# EAGLE design ioshield (EAGLE 7.2.0)
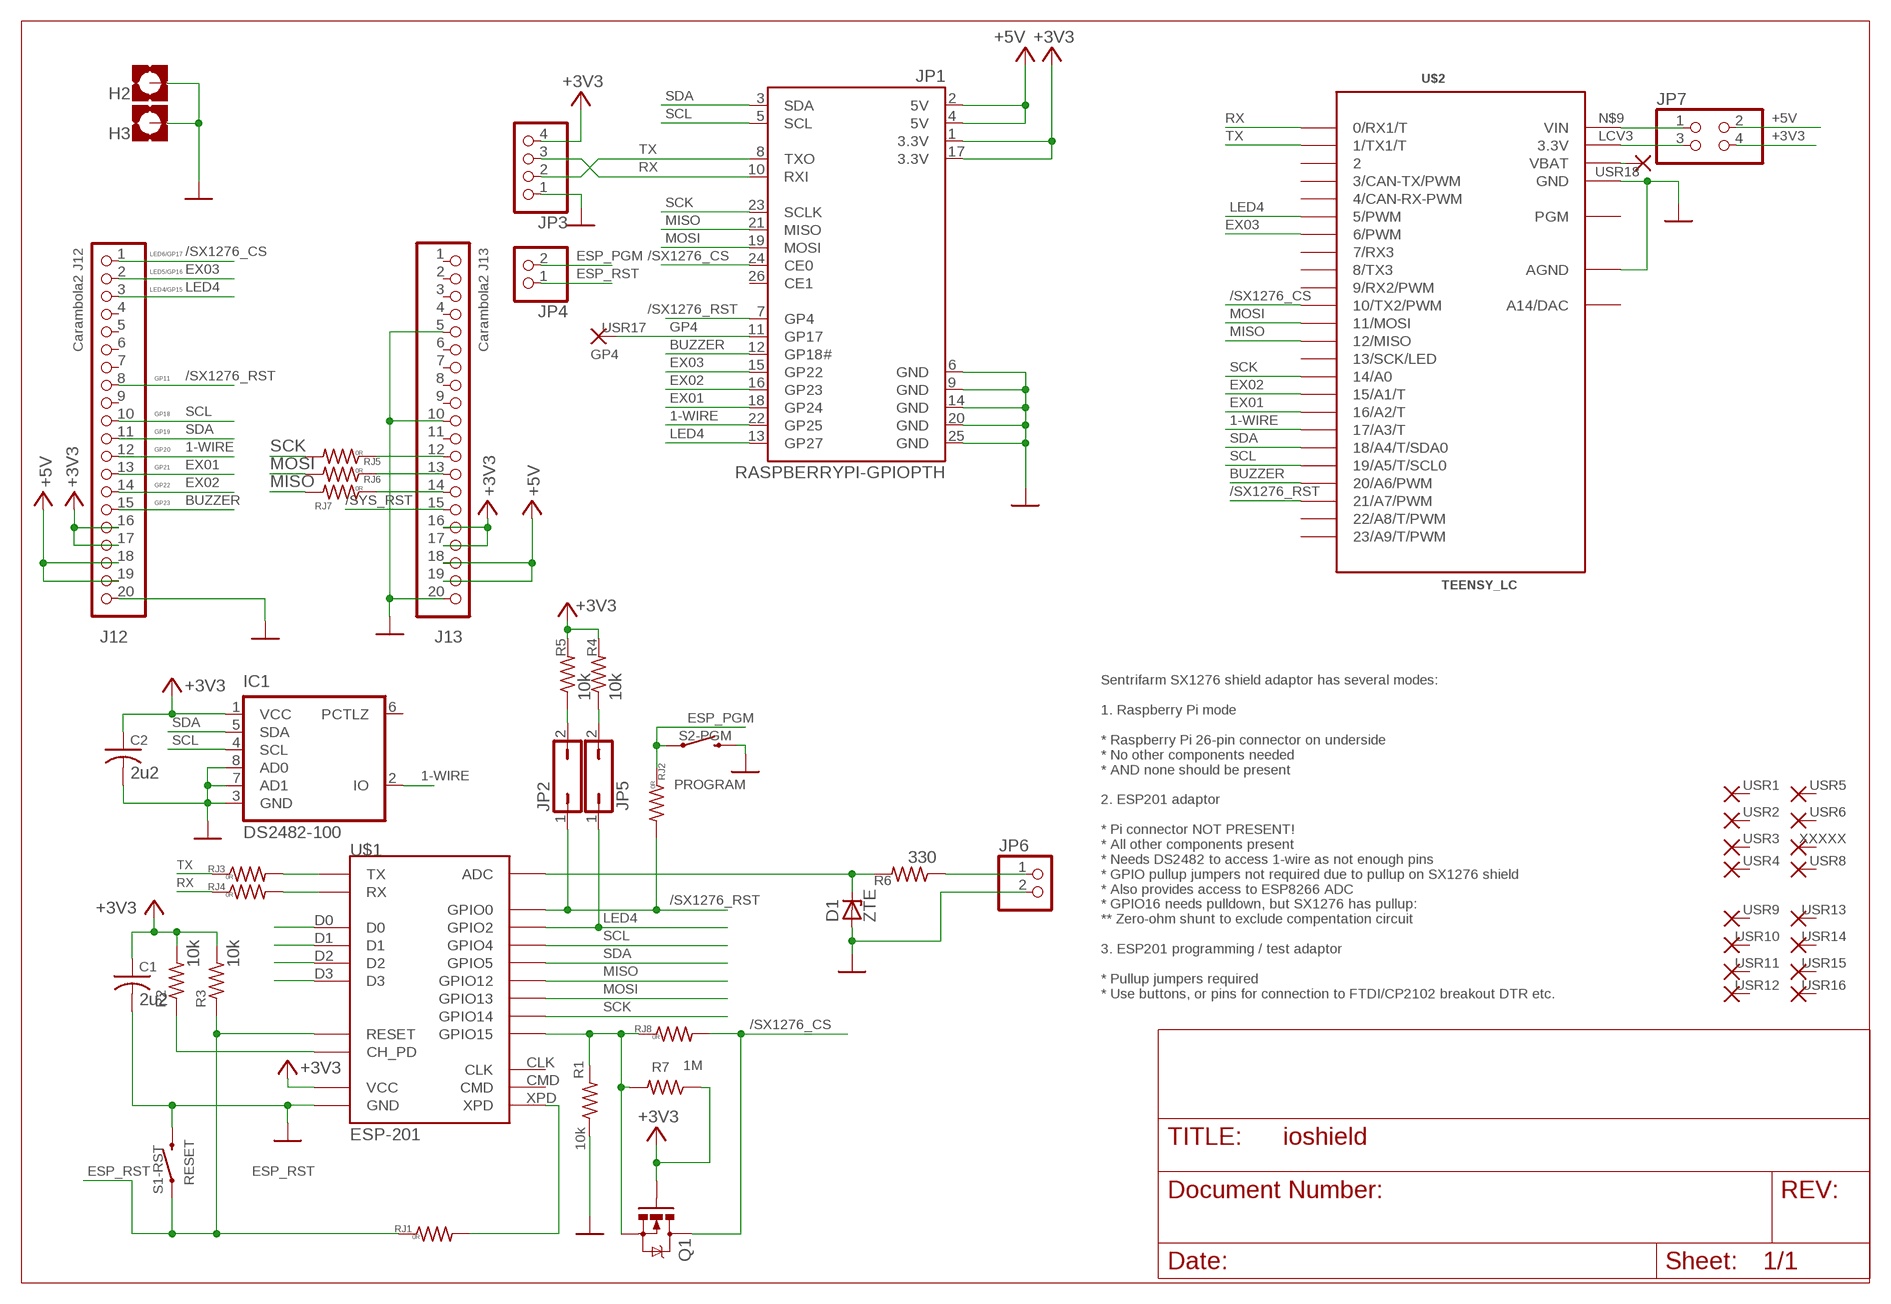
[diagram p0: schematic, sheet 1]

## Parts
C1  2u2  C-USC1206  [C1206]
C2  2u2  C-USC1206  [C1206]
D1  ZTE  [DO35Z10]
H2  MOUNT-PAD-SQUARE3.2  [3,2-PAD-SQUARE]
H3  MOUNT-PAD-SQUARE3.2  [3,2-PAD-SQUARE]
IC1  DS2482-100  [SO08]
J12  Carambola2 J12  PINHD-1X20  [1X20]
J13  Carambola2 J13  PINHD-1X20  [1X20]
JP1  RASPBERRYPI-GPIOPTH  [2X13-SHROUDED]
JP2  JP1Q  [JP1]
JP3  PINHD-1X4  [1X04]
JP4  PINHD-1X2  [1X02]
JP5  JP1Q  [JP1]
JP6  PINHD-1X2  [1X02]
JP7  PINHD-2X2  [2X02]
Q1  MOSFET-NCHANNEL2N7000  [TO-92]
R1  10k  R-US_M1206  [M1206]
R2  10k  R-US_M1206  [M1206]
R3  10k  R-US_M1206  [M1206]
R4  10k  R-US_M1206  [M1206]
R5  10k  R-US_M1206  [M1206]
R6  330  R-US_M1206  [M1206]
R7  1M  R-US_M1206  [M1206]
RJ1  0R  R-US_M1206  [M1206]
RJ2  0R  R-US_M1206  [M1206]
RJ3  0R  R-US_M1206  [M1206]
RJ4  0R  R-US_M1206  [M1206]
RJ5  0R  R-US_M1206  [M1206]
RJ6  0R  R-US_M1206  [M1206]
RJ7  0R  R-US_M1206  [M1206]
RJ8  0R  R-US_M1206  [M1206]
S1-RST  SWITCH-MOMENTARY-2PTH  [TACTILE-PTH]
S2-PGM  SWITCH-MOMENTARY-2PTH  [TACTILE-PTH]
U$1  ESP-201  [ESP-201]
U$2  TEENSY_LC  TEENSY_3.1_BASIC  [TEENSY_3.1_BASIC]
USR1  1,6/0,8  [1,6/0,8]
USR2  1,6/0,8  [1,6/0,8]
USR3  1,6/0,8  [1,6/0,8]
USR4  1,6/0,8  [1,6/0,8]
USR5  1,6/0,8  [1,6/0,8]
USR6  1,6/0,8  [1,6/0,8]
USR8  1,6/0,8  [1,6/0,8]
USR9  1,6/0,8  [1,6/0,8]
USR10  1,6/0,8  [1,6/0,8]
USR11  1,6/0,8  [1,6/0,8]
USR12  1,6/0,8  [1,6/0,8]
USR13  1,6/0,8  [1,6/0,8]
USR14  1,6/0,8  [1,6/0,8]
USR15  1,6/0,8  [1,6/0,8]
USR16  1,6/0,8  [1,6/0,8]
USR17  GP4  1,6/0,8  [1,6/0,8]
USR18  1,6/0,8  [1,6/0,8]
XXXXX  1,6/0,8  [1,6/0,8]

## Nets
1-WIRE: IC1.2(IO) J12.12 JP1.22(GP25) U$2.17/A3(17/A3/T)
+3V3 [power]: C1.1 C2.1 IC1.1(VCC) J12.16 J12.17 J13.16 J13.17 JP1.1(3.3V) JP1.17(3.3V) JP3.4 JP7.4 Q1.2(G) R2.2 R3.2 R4.2 R5.2 R7.1 U$1.3V3(VCC) U$1.3V3_2(VCC) U$1.3V3_3(VCC)
+5V [power]: J12.18 J12.19 J13.18 J13.19 JP1.2(5V) JP1.4(5V) JP7.2
/SX1276_CS: J12.1 JP1.24(CE0) Q1.3(D) RJ8.2 U$2.10(10/TX2/PWM)
/SX1276_RST: J12.8 JP1.7(GP4) JP2.1 RJ2.2 U$1.GPIO0 U$2.21/A7(21/A7/PWM)
/SYS_RST: J13.15
BUZZER: J12.15 JP1.12(GP18#) U$2.20/A6(20/A6/PWM)
CH_PD: R2.1 U$1.CH_PD
ESP_ADC: D1.C R6.2 U$1.ADC
ESP_GPIO15: Q1.1(S) R1.2 R7.2 RJ8.1 U$1.GPIO15
ESP_PGM: JP4.2 RJ2.1 S2-PGM.1
ESP_RST: JP4.1 R3.1 RJ1.1 S1-RST.1 U$1.RST(RESET)
EX01: J12.13 JP1.18(GP24) U$2.16/A2(16/A2/T)
EX02: J12.14 JP1.16(GP23) U$2.15/A1(15/A1/T)
EX03: J12.2 JP1.15(GP22) U$2.6(6/PWM)
GND: C1.2 C2.2 D1.A H2.B3,2(MOUNT) H3.B3,2(MOUNT) IC1.3(GND) IC1.7(AD1) IC1.8(AD0) J12.20 J13.5 J13.10 J13.20 JP1.6(GND) JP1.9(GND) JP1.14(GND) JP1.20(GND) JP1.25(GND) JP3.1 JP6.2 R1.1 S1-RST.3 S2-PGM.3 U$1.GND U$1.GND_2(GND) U$1.GND_3(GND) U$2.AGND U$2.GND U$2.GND1(GND)
GP4: JP1.11(GP17) USR17.1(P)
LCV3: JP7.3 U$2.3.3V U$2.3.3V1(3.3V)
LED4: J12.3 JP1.13(GP27) JP5.1 U$1.GPIO2 U$2.5(5/PWM)
MISO: JP1.21(MISO) RJ7.2 U$1.GPIO12 U$2.12(12/MISO)
MOSI: JP1.19(MOSI) RJ6.2 U$1.GPIO13 U$2.11(11/MOSI)
N$1: JP2.2 R5.1
N$2: JP5.2 R4.1
N$3: JP6.1 R6.1
N$4: RJ3.2
N$5: U$1.D1
N$6: U$2.VBAT USR18.1(P)
N$7: U$1.D3
N$8: U$1.D2
N$9: JP7.1 U$2.VIN
N$10: U$1.D0
N$11: RJ4.2
NXXX1: J13.12 RJ5.1
NXXX2: J13.13 RJ6.1
NXXX3: J13.14 RJ7.1
RX: JP1.10(RXI) JP3.3 RJ4.1 U$2.0(0/RX1/T)
SCK: JP1.23(SCLK) RJ5.2 U$1.GPIO14 U$2.14/A0
SCL: IC1.4(SCL) J12.10 JP1.5(SCL) U$1.GPIO4 U$2.19/A5(19/A5/T/SCL0)
SDA: IC1.5(SDA) J12.11 JP1.3(SDA) U$1.GPIO5 U$2.18/A4(18/A4/T/SDA0)
TX: JP1.8(TXO) JP3.2 RJ3.1 U$2.1(1/TX1/T)
XPD: RJ1.2 U$1.XPD
Unconnected: IC1.6(PCTLZ) J12.4 J12.5 J12.6 J12.7 J12.9 J13.1 J13.2 J13.3 J13.4 J13.6 J13.7 J13.8 J13.9 J13.11 JP1.26(CE1) U$1.CLK U$1.CMD U$1.RX U$1.TX U$2.2 U$2.3(3/CAN-TX/PWM) U$2.4(4/CAN-RX-PWM) U$2.7(7/RX3) U$2.8(8/TX3) U$2.9(9/RX2/PWM) U$2.13(13/SCK/LED) U$2.22/A8(22/A8/T/PWM) U$2.23/A9(23/A9/T/PWM) U$2.A14(A14/DAC) U$2.PGM USR1.1(P) USR2.1(P) USR3.1(P) USR4.1(P) USR5.1(P) USR6.1(P) USR8.1(P) USR9.1(P) USR10.1(P) USR11.1(P) USR12.1(P) USR13.1(P) USR14.1(P) USR15.1(P) USR16.1(P) XXXXX.1(P)

## Notes on the sheet
- LED6/GP17
- LED5/GP16
- LED4/GP15
- GP11
- GP18
- GP19
- GP20
- GP21
- GP22
- GP23
- PROGRAM
- Sentrifarm SX1276 shield adaptor has several modes:
  
  1. Raspberry Pi mode
  
  * Raspberry Pi 26-pin connector on underside
  * No other components needed
  * AND none should be present
  
  2. ESP201 adaptor
  
  * Pi connector NOT PRESENT!
  * All other components present
  * Needs DS2482 to access 1-wire as not enough pins
  * GPIO pullup jumpers not required due to pullup on SX1276 shield
  * Also provides access to ESP8266 ADC
  * GPIO16 needs pulldown, but SX1276 has pullup:
  ** Zero-ohm shunt to exclude compentation circuit
  
  3. ESP201 programming / test adaptor
  
  * Pullup jumpers required 
  * Use buttons, or pins for connection to FTDI/CP2102 breakout DTR etc.
- RESET

## Library data of the parts
C1 C2 = resistor:C-US: CAPACITOR, American symbol
D1 = diode:ZTE: Z DIODE 300 mW
H2 H3 = holes:MOUNT-PAD-SQUARE: MOUNTING PAD, square
IC1 = poepi-myparts:DS2482-100: Single channel 1-Wire master with I2C interface
J12 J13 = PINHEAD:PINHD-1X20
JP1 = SparkFun-Boards:RASPBERRYPI-GPIO: RASPBERRY PI I/O HEADER As defined for the Revistion 2 Pi.; DIST: sparkfun; DIST_ID: PRT-11490
JP2 JP5 = jumper:JP1Q: JUMPER
JP3 = PINHEAD:PINHD-1X4: PIN HEADER
JP4 JP6 = PINHEAD:PINHD-1X2: PIN HEADER
JP7 = PINHEAD:PINHD-2X2: PIN HEADER
Q1 = SparkFun-DiscreteSemi:MOSFET-NCHANNEL: Common NMOSFET Parts MFG P/N Store ID Prod ID FDD8780 TRANS-09984 SI7820DN TRANS-11055 FDS6630A IC-08089 2N7002PW TRANS-11151 FQP30N06L COM-10213 TRANS-10060 BSS123LT1G TRANS-08345 BSS138 TRANS-00830 BS170 2N7000
R1-R7 RJ1-RJ8 = resistor:R-US_: RESISTOR, American symbol
S1-RST S2-PGM = SparkFun-Electromechanical:SWITCH-MOMENTARY-2: Various NO switches- pushbuttons, reed, etc; PROD_ID: SWCH-08441
U$1 = esp8266modules:ESP-201: ESP8266 Wifi Module ESP-201; DIMENSIONS: 25 x 35 mm; PINS: 26; PITCH: 0.1" / 2.54 mm
U$2 = Teensy_3_Series_Board_v1.0:TEENSY_3.1_BASIC: Footprint for Teensy 3.1 board using all pin connections on the outer perimeter
USR1-USR6 USR8-USR18 XXXXX = wirepad:1,6/0,8: THROUGH-HOLE PAD

## Net classes
1 power: width 0.305 mm

## Board
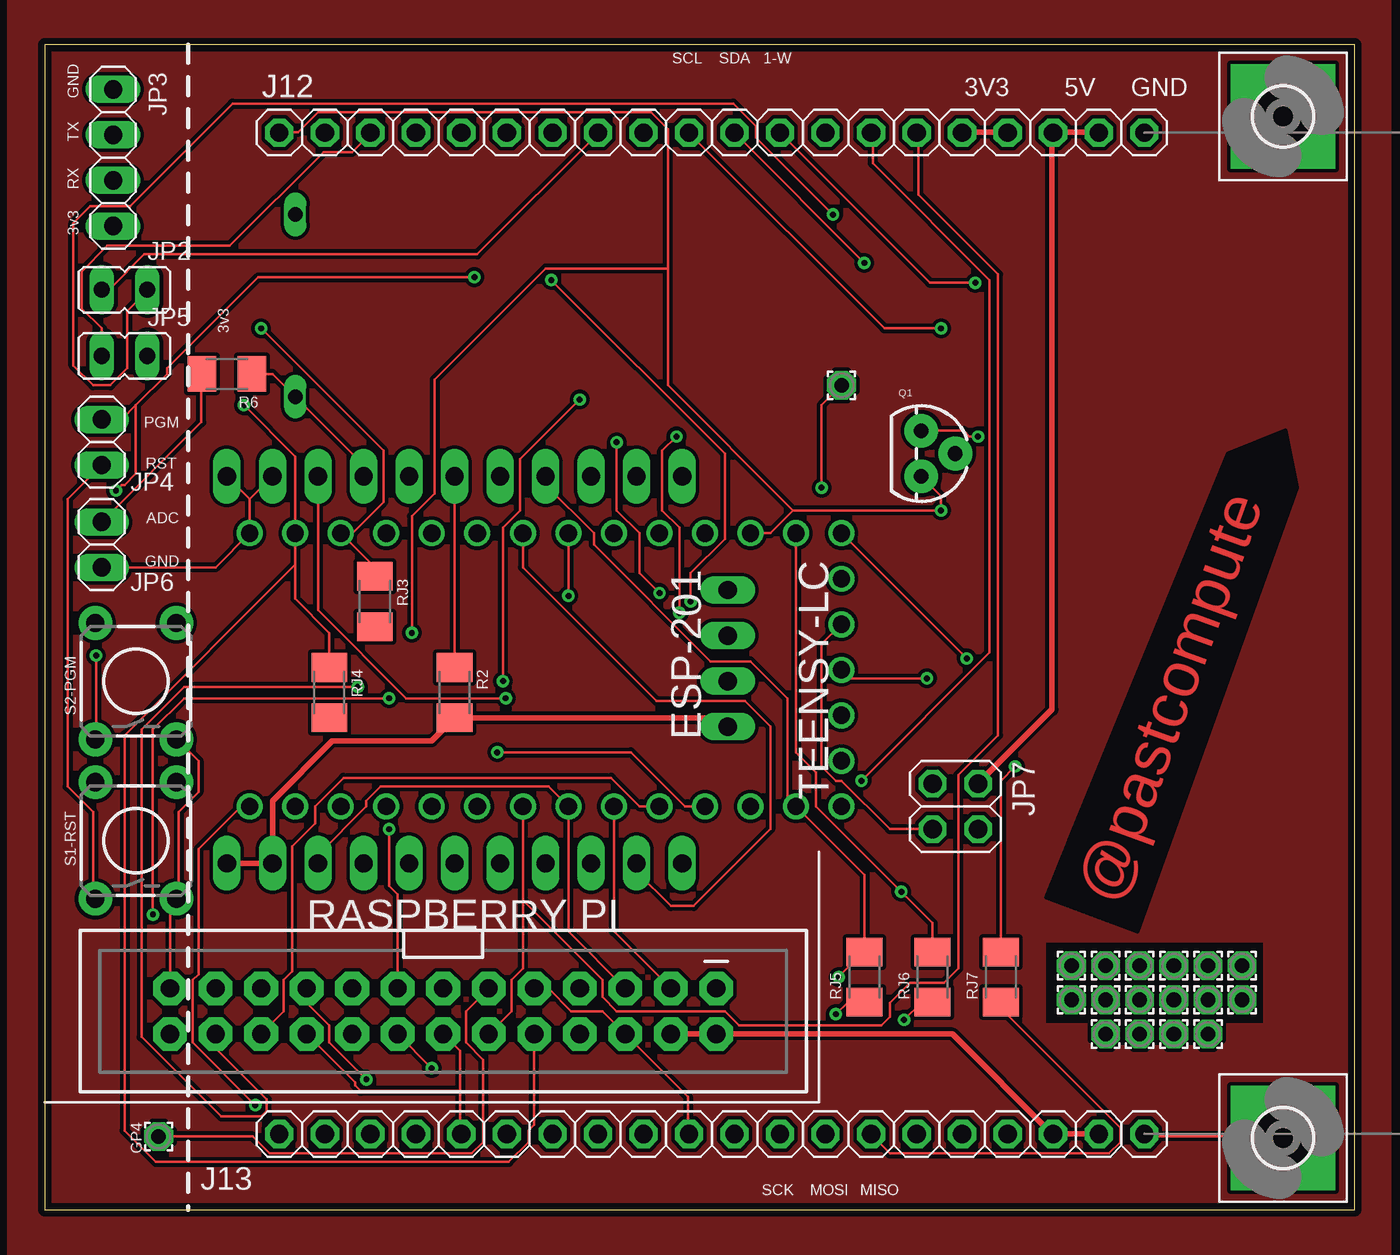
[diagram p1: board, top side]
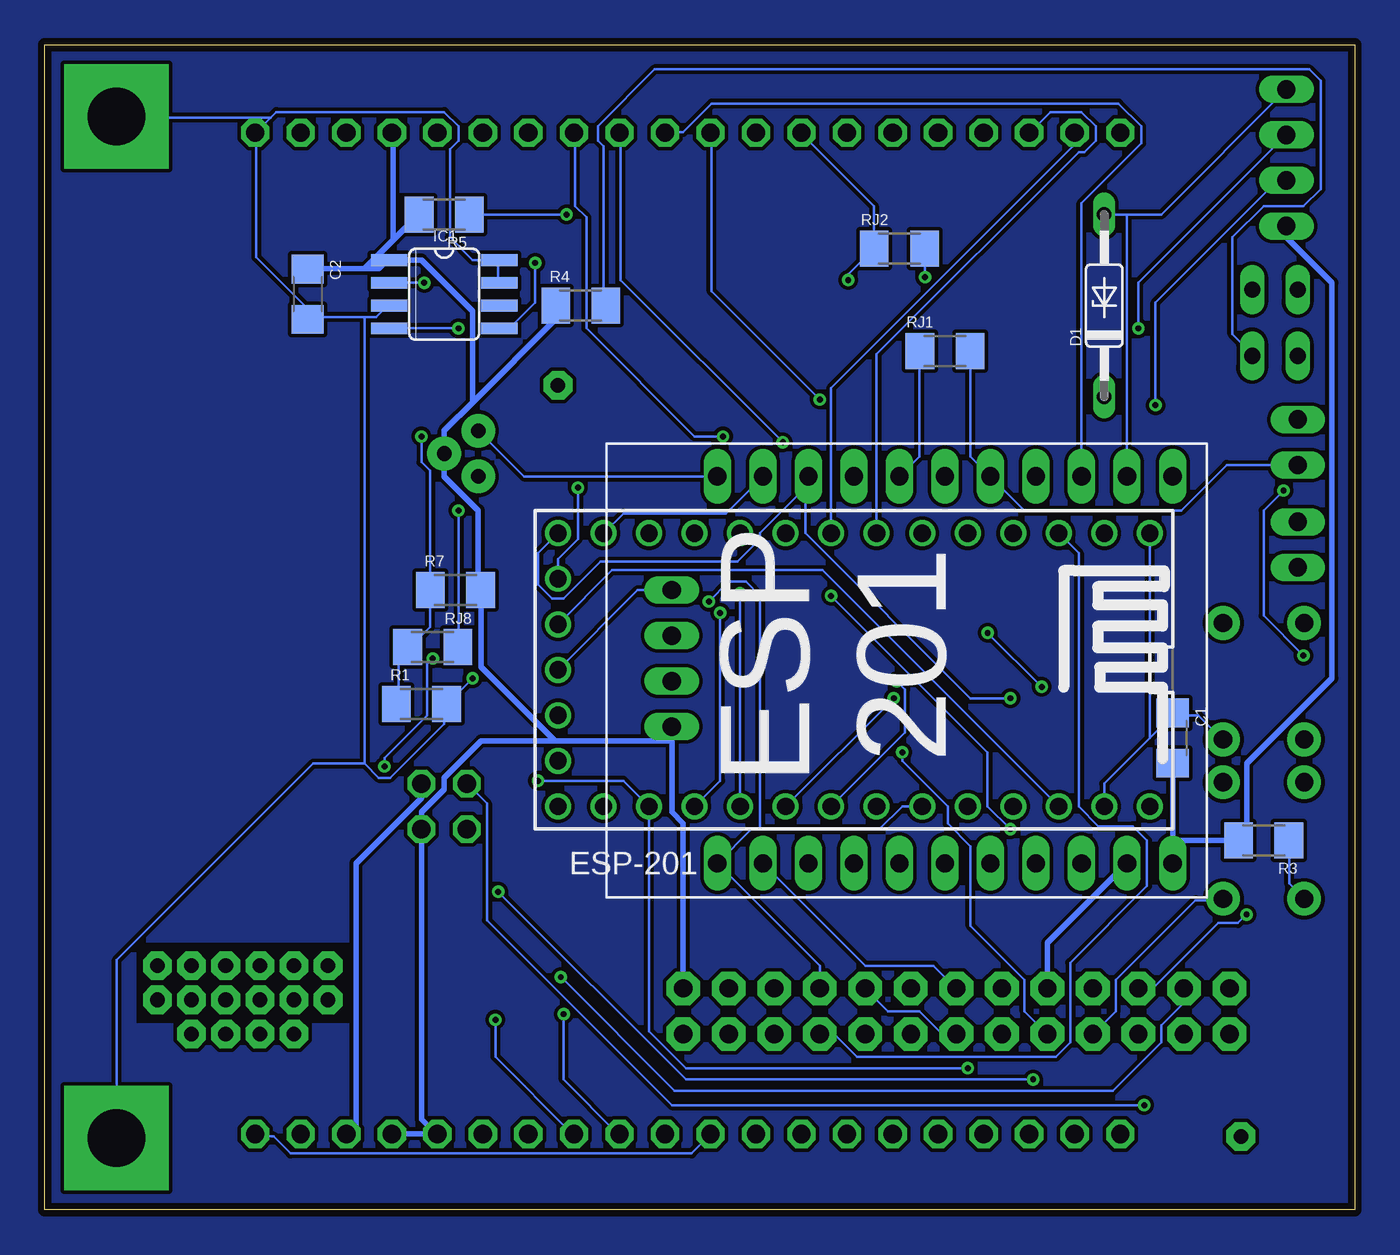
[diagram p2: board, bottom side, seen from below]

Size 73.08 x 65 mm. Coordinates in mm from the lower left corner, seen from the top.
Outline: 0,0 73.08,0 73.08,65 0,65 0,0
Copper layers (1*16): Top 0.0356mm / dielectric 1.5011mm / Bottom 0.0356mm
Design rules "LaenPCBOrder *": minimum track width 6mil, minimum drill 13mil, track to track 8mil, track to pad 8mil, pad to pad 8mil, via to via 8mil, smd to smd 6mil, copper to edge 15mil, drill to drill 6mil, minimum pad ring 7mil, minimum via ring 7mil, stop-mask expansion 3mil, vias tented up to drill 0mil, thermal gap 10mil
tRestrict: area 55.9,10.4 to 67.9,14.9; area 55.9,15.5 to 69.9,43.5
bRestrict: area 55.9,10.4 to 67.9,14.9
vRestrict: area 57.9,18.4 to 73.2,37.7

### Footprints (pad centres in the part's own frame; a part is rotated, then mirrored left to right if it is on the bottom)
C1206 = smd 1.6 x 1.8: 1 -1.4,0; 2 1.4,0
DO35Z10 = drill 0.813 long: A 5.08,0; C -5.08,0
3,2-PAD-SQUARE = drill 3.2 pad 5.842 square: B3,2 0,0
SO08 = smd 0.66 x 2.032: 1 -1.905,-3.073; 2 -0.635,-3.073; 3 0.635,-3.073; 4 1.905,-3.073; 5 1.905,3.073; 6 0.635,3.073; 7 -0.635,3.073; 8 -1.905,3.073
1X20 = drill 1.016 pad 1.575 octagon: 1 -24.13,0; 2 -21.59,0; 3 -19.05,0; 4 -16.51,0; 5 -13.97,0; 6 -11.43,0; 7 -8.89,0; 8 -6.35,0; 9 -3.81,0; 10 -1.27,0; 11 1.27,0; 12 3.81,0; 13 6.35,0; 14 8.89,0; 15 11.43,0; 16 13.97,0; 17 16.51,0; 18 19.05,0; 19 21.59,0; 20 24.13,0
2X13-SHROUDED = drill 1.016 pad 1.88 octagon: 1 -1.27,15.24; 2 1.27,15.24; 3 -1.27,12.7; 4 1.27,12.7; 5 -1.27,10.16; 6 1.27,10.16; 7 -1.27,7.62; 8 1.27,7.62; 9 -1.27,5.08; 10 1.27,5.08; 11 -1.27,2.54; 12 1.27,2.54; 13 -1.27,0; 14 1.27,0; 15 -1.27,-2.54; 16 1.27,-2.54; 17 -1.27,-5.08; 18 1.27,-5.08; 19 -1.27,-7.62; 20 1.27,-7.62; 21 -1.27,-10.16; 22 1.27,-10.16; 23 -1.27,-12.7; 24 1.27,-12.7; 25 -1.27,-15.24; 26 1.27,-15.24
JP1 = drill 0.914 long: 1 0,-1.27; 2 0,1.27
1X04 = drill 1.016 long: 1 -3.81,0; 2 -1.27,0; 3 1.27,0; 4 3.81,0
1X02 = drill 1.016 long: 1 -1.27,0; 2 1.27,0
2X02 = drill 1.016 octagon: 1 -1.27,-1.27; 2 -1.27,1.27; 3 1.27,-1.27; 4 1.27,1.27
TO-92 = drill 0.813 pad 1.88: 1 -1.27,0; 2 0,1.905; 3 1.27,0
M1206 = smd 1.6 x 2: 1 -1.4,0; 2 1.4,0
TACTILE-PTH = drill 1.016 pad 1.88: 1 -3.251,2.261; 2 3.251,2.261; 3 -3.251,-2.261; 4 3.251,-2.261
ESP-201 = drill 1.016 long: 3V3 0,2.54; 3V3_2 0,0; 3V3_3 7.62,27.94; ADC 21.59,7.62; CH_PD 21.59,12.7; CLK 0,17.78; CMD 0,15.24; D0 0,12.7; D1 0,10.16; D2 0,20.32; D3 0,7.62; GND 21.59,2.54; GND_2 21.59,0; GND_3 15.24,27.94; GPIO0 0,25.4; GPIO2 0,22.86; GPIO4 0,5.08; GPIO5 21.59,5.08; GPIO12 21.59,20.32; GPIO13 21.59,22.86; GPIO14 21.59,17.78; GPIO15 21.59,25.4; RST 21.59,10.16; RX 10.16,27.94; TX 12.7,27.94; XPD 21.59,15.24
TEENSY_3.1_BASIC = drill 0.965: 0 -7.62,13.97; 1 -7.62,11.43; 2 -7.62,8.89; 3 -7.62,6.35; 3.3V 7.62,11.43; 3.3V1 -2.54,-16.51; 4 -7.62,3.81; 5 -7.62,1.27; 6 -7.62,-1.27; 7 -7.62,-3.81; 8 -7.62,-6.35; 9 -7.62,-8.89; 10 -7.62,-11.43; 11 -7.62,-13.97; 12 -7.62,-16.51; 13 7.62,-16.51; 14/A0 7.62,-13.97; 15/A1 7.62,-11.43; 16/A2 7.62,-8.89; 17/A3 7.62,-6.35; 18/A4 7.62,-3.81; 19/A5 7.62,-1.27; 20/A6 7.62,1.27; 21/A7 7.62,3.81; 22/A8 7.62,6.35; 23/A9 7.62,8.89; A14 5.08,-16.51; AGND 7.62,13.97; GND -7.62,16.51; GND1 0,-16.51; PGM 2.54,-16.51; VBAT -5.08,-16.51; VIN 7.62,16.51
1,6/0,8 = drill 0.813 pad 1.6 octagon: 1 0,0

### Placement (x,y rotation side)
C1  10.16,26.32 90 bottom
C2  58.42,51.08 270 bottom
D1  13.97,50.45 90 bottom
H2  69.08,61 0 top
H3  69.08,4 0 top
IC1  50.8,51.08 270 bottom
J12  37.21,60.1 0 top
J13  37.21,4.23 0 top
JP1  22.23,11.08 270 top
JP2  4.44,51.34 270 top
JP3  3.81,58.7 270 top
JP4  3.17,42.83 90 top
JP5  4.44,47.65 270 top
JP6  3.17,37.11 270 top
JP7  50.8,22.51 270 top
Q1  48.89,42.19 270 top
R1  52.07,28.22 180 bottom
R2  22.86,28.86 270 top
R3  5.08,20.6 180 bottom
R4  43.18,50.45 180 bottom
R5  50.8,55.53 180 bottom
R6  10.16,46.64 0 top
R7  50.16,34.57 180 bottom
RJ1  22.86,47.91 180 bottom
RJ2  25.4,53.62 180 bottom
RJ3  18.41,33.94 270 top
RJ4  15.87,28.86 270 top
RJ5  45.72,12.98 90 top
RJ6  49.53,12.98 90 top
RJ7  53.34,12.98 90 top
RJ8  51.43,31.4 0 bottom
S1-RST  5.08,20.6 90 top
S2-PGM  5.08,29.49 90 top
U$1  10.16,19.33 90 bottom
U$2  27.94,30.13 270 bottom
USR1  62.99,13.62 0 top
USR2  64.9,13.62 0 top
USR3  62.99,9.81 0 top
USR4  61.09,13.62 0 top
USR5  64.9,9.81 0 top
USR6  57.28,11.71 0 top
USR8  59.18,13.62 0 top
USR9  61.09,9.81 0 top
USR10  59.18,11.71 0 top
USR11  59.18,9.81 0 top
USR12  66.8,13.62 0 top
USR13  61.09,11.71 0 top
USR14  62.99,11.71 0 top
USR15  66.8,11.71 0 top
USR16  64.9,11.71 0 top
USR17  6.35,4.09 0 top
USR18  44.45,46 0 top
XXXXX  57.28,13.62 0 top

### Tracks (layer width: path | path; a pad name or v marks a point on that pad's centre or on a via)
1-WIRE  (via drill 0.33)
  Top 0.152: v51.91,51.72 49.37,51.72 41.12,59.97 J12.12 | U$2.17/A3 33.18,22.51 31.59,24.1 16.67,24.1 15.08,22.51 15.08,21.56 13.81,20.29 13.81,13.3 13.33,12.82 13.33,11.08 JP1.22 | v31.91,42.83 31.91,39.02 33.18,37.75 33.18,35.52 v34.29,34.41
  Bottom 0.152: v51.91,51.72 IC1.2 | v31.91,42.83 40.96,51.88 40.96,59.97 J12.12 | U$2.17/A3 v34.29,34.41
+3V3
  Top 0.305: U$1.3V3_2 U$1.3V3 12.7,22.83 16.03,26.16 21.59,26.16 22.86,27.43 | J12.16 51.28,60.13 53.66,60.13 J12.17 | 22.86,27.43 37.62,27.43 U$1.3V3_3 | 22.86,27.43 R2.2
  Bottom 0.305: 10.16,20.6 C1.1 | 10.16,20.6 R3.2 6.35,20.6 6.03,20.92 6.03,24.89 1.27,29.65 1.27,51.72 3.81,54.26 JP3.4 | 10.16,20.6 U$1.3V3_2 | JP1.17 17.14,14.89 U$1.3V3 | 55.24,52.51 54.45,52.51 53.97,52.99 IC1.1 52.07,52.99 49.21,50.13 49.21,45.21 49.13,45.13 | 55.24,52.51 58.42,52.51 C2.1 | 55.24,52.51 53.58,54.18 | 53.58,54.18 52.23,55.53 R5.2 | J12.17 53.66,59.97 53.66,54.26 53.58,54.18 | 49.13,45.13 50.8,43.46 Q1.2 50.8,40.92 48.89,39.02 48.89,34.57 R7.1 48.74,34.57 48.74,30.29 44.61,26.16 | 49.13,45.13 44.61,49.65 44.61,50.45 R4.2 | J13.17 53.66,4.25 51.43,4.25 J13.16 51.28,4.25 52.07,5.04 JP7.4 52.07,22.19 50.8,23.46 50.8,24.1 48.74,26.16 44.61,26.16 | JP1.1 37.46,21.56 38.1,22.19 38.1,26.16 | U$1.3V3_3 38.1,26.16 | 38.1,26.16 44.61,26.16
+5V
  Top 0.305: JP1.4 JP1.2 50.64,9.81 56.2,4.25 J13.18 56.36,4.25 58.74,4.25 J13.19 | J12.19 58.74,60.13 56.36,60.13 J12.18 56.2,59.97 56.2,27.91 JP7.2
  Bottom 0.305: JP7.2 52.07,22.98 55.72,19.33 55.72,4.73 56.2,4.25 J13.18
/SX1276_CS  (via drill 0.33)
  Top 0.152: Q1.3 50.01,39.81 v50.01,39.02 41.75,39.02 | U$2.10 40.48,37.75 41.75,39.02 | 34.77,52.51 34.77,46 41.75,39.02 | 34.77,52.51 34.77,60.29 33.81,61.24 15.24,61.24 14.13,60.13 13.18,60.13 J12.1 | JP1.24 9.53,9.01 12.38,6.16 12.38,5.52 12.06,5.2 9.84,5.2 5.4,9.65 5.4,26.79 7.78,29.18 v17.46,29.18 | v20.48,32.19 20.48,38.7 21.75,39.97 21.75,46.32 27.94,52.51 34.77,52.51
  Bottom 0.152: v50.01,39.02 50.01,31.4 RJ8.2 | v20.48,32.19 v17.46,29.18
/SX1276_RST  (via drill 0.33)
  Top 0.152: JP2.1 3.17,51.4 3.65,51.4 5.56,53.31 24.13,53.31 30.8,59.97 J12.8 | v36.04,33.94 36.04,35.52 37.94,37.43 37.94,42.19 v28.26,51.88
  Bottom 0.152: U$2.21/A7 25.24,22.51 26.51,21.24 33.18,21.24 | 33.18,21.24 33.65,21.24 U$1.GPIO0 29.84,13.62 JP1.7 | 26.83,53.62 26.83,56 30.8,59.97 J12.8 | 33.18,21.24 33.18,34.26 33.97,35.05 34.92,35.05 v36.04,33.94 | v28.26,51.88 28.26,52.19 26.83,53.62 | 26.83,53.62 RJ2.2
BUZZER
  Top 0.152: 26.67,17.27 26.67,13.46 26.03,12.82 26.03,11.08 JP1.12 | 26.67,17.27 U$2.20/A6 | 26.67,17.27 31.11,12.82 31.11,11.87 31.91,11.08 37.94,11.08 38.73,10.28 46.67,10.28 47.15,10.76 47.15,11.55 48.26,12.67 50.16,12.67 50.96,13.46 50.96,24.25 53.18,26.48 53.18,52.19 48.74,56.64 48.74,59.97 J12.15
CH_PD
  Top 0.152: U$1.CH_PD R2.1
ESP_ADC
  Top 0.152: R6.2 12.7,46.64 D1.C 17.78,41.56 U$1.ADC
ESP_GPIO15  (via drill 0.33)
  Top 0.152: v52.07,43.15 51.59,43.15 51.28,43.46 Q1.1
  Bottom 0.152: R1.2 53.34,28.22 53.34,30.92 52.86,31.4 RJ8.1 52.7,31.4 51.59,32.51 51.59,34.57 | U$1.GPIO15 46.35,40.92 Q1.1 | 51.59,34.57 51.59,41.24 52.07,41.72 v52.07,43.15 | 51.59,34.57 R7.2
ESP_PGM  (via drill 0.33)
  Top 0.152: v23.97,52.03 11.91,52.03 6.83,46.95 6.83,46.64 5.08,44.89 | 5.08,44.89 4.29,44.1 JP4.2 | v2.86,30.92 2.86,26.32 S2-PGM.1 | v3.97,40.13 4.29,40.45 4.44,40.45 5.08,41.08 5.08,44.89
  Bottom 0.152: v23.97,52.03 23.97,53.62 RJ2.1 | v2.86,30.92 5.08,33.14 5.08,39.02 v3.97,40.13
ESP_RST
  Top 0.152: JP4.1 1.27,39.65 1.27,23.62 2.7,22.19 2.7,17.43 S1-RST.1
  Bottom 0.152: R3.1 3.65,20.6 3.65,18.22 2.86,17.43 S1-RST.1 | RJ1.1 21.43,47.91 21.43,42.03 U$1.RST 18.41,39.02 9.68,39.02 7.14,41.56 JP4.1
EX01  (via drill 0.33)
  Top 0.152: U$2.16/A2 35.72,22.51 32.7,25.52 v25.24,25.52 | v35.24,43.15 34.45,42.35 34.45,39.02 35.4,38.06 v35.4,33.3
  Bottom 0.152: v25.24,25.52 25.24,25.05 22.7,22.51 22.7,21.56 21.43,20.29 21.43,15.84 18.41,12.82 18.41,11.08 JP1.18 | v35.24,43.15 36.83,43.15 42.86,49.18 42.86,55.37 43.5,56 43.5,59.97 J12.13 | v35.4,33.3 35.4,23.94 U$2.16/A2
EX02  (via drill 0.33)
  Top 0.152: JP1.16 v21.59,7.9 | v45.56,23.94 52.7,31.08 52.7,51.88 46.2,58.39 46.2,59.97 J12.14
  Bottom 0.152: v21.59,7.9 37.31,7.9 39.37,9.97 U$2.15/A1 40.8,23.94 v45.56,23.94
EX03  (via drill 0.33)
  Top 0.152: JP1.15 19.69,17.59 19.21,18.06 v19.21,21.24 | U$2.6 v29.21,34.26
  Bottom 0.152: U$2.6 29.21,45.84 15.72,59.34 15.72,59.97 J12.2 | v19.21,21.24 20.48,22.51 20.48,25.52 v29.21,34.26
GND  (via drill 0.33)
  Top 0.152: v49.21,29.65 44.93,29.65 U$2.GND1 | 11.43,39.65 U$2.GND 9.53,35.84 JP6.2 | U$1.GND_2 11.43,39.65 | 11.43,39.65 U$1.GND | JP1.25 6.98,16.95 7.3,17.27 S1-RST.3 7.46,17.43 7.46,22.19 8.57,23.3 8.57,25.05 7.46,26.16 S2-PGM.3 | J13.20 61.44,4.09 69.06,4.09 H3.B3,2 | 23.18,6.63 23.18,8.86 JP1.14 | 23.18,6.63 23.18,4.25 J13.5 | JP1.20 17.3,7.11 17.3,6.95 17.62,6.63 23.18,6.63 | J13.10 35.88,4.25 35.88,6.31 JP1.6 31.11,11.08 29.37,11.08 28.1,12.35 JP1.9
  Bottom 0.152: v49.21,29.65 50.64,28.22 R1.1 50.8,28.22 50.8,27.11 53.82,24.1 54.45,24.1 55.24,24.89 | U$1.GND_3 40,34.57 U$2.GND1 | 55.24,49.81 54.61,49.81 53.97,50.45 IC1.3 | 55.24,49.81 58.42,49.81 | 47.78,52.99 47.78,51.72 IC1.7 | 47.78,52.99 49.21,52.99 50.48,54.26 50.48,59.18 50.01,59.66 50.01,60.45 50.8,61.24 60.17,61.24 60.48,60.92 | 60.48,60.92 61.28,60.13 J12.20 61.28,59.97 61.28,53.15 58.42,50.29 58.42,49.81 | 47.78,52.99 IC1.8 | 58.42,49.81 C2.2 | 55.24,49.81 55.24,24.89 | 60.48,60.92 69.06,60.92 H2.B3,2 | 12.7,55.53 10.79,55.53 JP3.1 | 12.7,55.53 D1.A | 10.16,27.59 8.73,27.59 7.46,26.32 S2-PGM.3 | U$2.AGND 13.97,23.78 11.43,26.32 | 10.16,27.59 11.43,26.32 | 10.16,27.59 C1.2 | 11.43,26.32 U$2.GND | U$1.GND 12.7,55.53 | JP1.14 23.02,9.81 24.29,11.08 26.03,11.08 JP1.9 | J13.20 61.28,4.09 60.32,4.09 59.37,3.14 36.99,3.14 36.04,4.09 J13.10 | JP1.20 13.33,11.08 13.33,12.82 8.89,17.27 7.46,17.27 S1-RST.3 | 55.24,24.89 58.1,24.89 69.06,13.94 69.06,4.09 H3.B3,2
GP4
  Top 0.152: USR17.1 11.59,4.09 12.54,3.14 23.81,3.14 24.45,3.78 24.45,8.38 23.49,9.33 23.49,11.08 JP1.11
LCV3
  Top 0.152: JP7.3 47.15,21.24 44.45,23.94 44.13,23.94 43.34,24.73 43.34,31.56 U$2.3.3V1
  Bottom 0.152: U$2.3.3V 29.69,35.68 41.43,35.68 U$2.3.3V1
LED4
  Top 0.152: JP5.1 3.17,49.18 2.06,50.29 2.06,52.35 3.49,53.78 10.32,53.78 15.56,59.02 17.14,59.02 18.1,59.97 J12.3 | U$1.GPIO2 33.02,18.86 34.92,16.95 36.2,16.95 40.48,21.24 40.48,26.95 39.05,28.38 34.13,28.38 26.67,35.84 U$2.5
  Bottom 0.152: U$1.GPIO2 27.3,13.62 23.49,13.62 JP1.13 | U$2.5 26.67,47.75 15.4,59.02 15.08,59.02 14.45,59.66 14.45,60.45 15.24,61.24 16.99,61.24 18.1,60.13 J12.3
MISO  (via drill 0.33)
  Top 0.152: RJ7.2 53.34,23.94 v54.13,24.73 | U$2.12 v51.43,30.76 | v6.03,16.48 6.03,26.79 7.78,28.54 v19.21,28.54
  Bottom 0.152: v54.13,24.73 54.13,25.21 51.75,27.59 51.75,30.45 v51.43,30.76 | 30.64,40.29 33.18,37.75 33.18,37.43 34.45,36.16 42.07,36.16 44.13,34.1 44.77,34.1 45.56,34.89 45.56,36.64 U$2.12 | 30.64,40.29 30.48,40.45 U$1.GPIO12 30.64,40.29 | JP1.21 11.27,12.35 7.62,16 6.51,16 v6.03,16.48 | v19.21,28.54 21.43,28.54 30.64,37.75 30.64,40.29
MOSI  (via drill 0.33)
  Top 0.152: RJ6.2 49.53,16 v47.78,17.75 43.02,22.51 43.02,24.41 41.91,25.52 U$2.11 | JP1.19 14.6,11.55 15.87,10.28 15.87,9.33 v17.94,7.27
  Bottom 0.152: U$1.GPIO13 35.08,38.86 40.8,38.86 U$2.11 | v17.94,7.27 37.31,7.27 v47.78,17.75
N$1  (via drill 0.33)
  Top 0.152: v43.97,55.53 39.69,59.81 39.69,60.45 38.42,61.72 10.48,61.72 4.76,56 2.54,56 1.59,55.05 1.59,47.11 2.7,46 3.65,46 4.6,46.95 4.6,50.13 5.71,51.24 JP2.2
  Bottom 0.152: v43.97,55.53 R5.1
N$2
  Bottom 0.152: R4.1 41.91,50.45 41.91,59.34 42.23,59.66 42.23,60.45 39.05,63.62 2.54,63.62 1.9,62.99 1.9,56.96 2.86,56 5.08,56 6.83,54.26 6.83,48.86 5.71,47.75 JP5.2
N$3
  Top 0.152: JP6.1 8.73,43.94 8.73,46.64 R6.1
N$6  (via drill 0.33)
  Top 0.152: v43.34,40.29 43.34,44.89 USR18.1
  Bottom 0.152: U$2.VBAT 44.45,36.32 43.34,37.43 v43.34,40.29
N$9  (via drill 0.33)
  Top 0.152: U$2.VIN 10.95,22.51 8.57,20.13 8.57,13.14 8.26,12.82 8.26,9.33 v11.75,5.84
  Bottom 0.152: v11.75,5.84 38.1,5.84 48.42,16.16 48.42,22.67 JP7.1
N$12
  pour Bottom: -4.45,72.67 78.11,72.67 78.11,-8.61 -4.45,-8.61
N$13
  pour Top: -1.91,74.58 74.93,74.58 74.93,-13.69 -1.91,-13.69
NXXX1  (via drill 0.33)
  Top 0.152: v44.13,10.92 44.77,11.55 45.72,11.55 RJ5.1
  Bottom 0.152: v44.13,10.92 44.13,7.27 41.12,4.25 J13.12
NXXX2  (via drill 0.33)
  Top 0.152: v47.94,10.6 48.89,11.55 49.53,11.55 RJ6.1
  Bottom 0.152: v47.94,10.6 47.94,8.54 43.66,4.25 J13.13
NXXX3
  Top 0.152: RJ7.1 53.34,11.24 60.01,4.57 60.01,3.78 59.37,3.14 47.15,3.14 46.2,4.09 J13.14
RX  (via drill 0.33)
  Top 0.152: RJ4.1 15.87,32.19 13.97,34.1 13.97,36 | 13.97,36 U$2.0 13.97,42.03 v11.11,44.89 | JP1.10 27.3,4.73 26.99,4.41 26.99,3.78 25.88,2.66 6.19,2.66 4.44,4.41 4.44,26.48 13.97,36
  Bottom 0.152: JP3.3 4.29,57.43 11.11,50.61 v11.11,44.89
SCK  (via drill 0.33)
  Top 0.152: 45.72,14.41 45.72,18.7 U$2.14/A0 41.43,22.98 41.43,28.54 39.37,30.6 37.15,30.6 30.64,37.11 30.64,37.75 27.94,40.45 U$1.GPIO14 | 45.72,14.41 v44.29,12.98 | 45.72,14.41 RJ5.2
  Bottom 0.152: JP1.23 9.53,11.55 10.79,10.28 10.79,9.33 13.49,6.63 37.94,6.63 v44.29,12.98
SCL  (via drill 0.33)
  Top 0.152: v50.01,49.18 46.83,49.18 36.04,59.97 J12.10 | JP1.5 29.21,15.52 U$2.19/A5 28.1,23.62 18.73,23.62 17.94,22.83 17.94,22.51 15.24,19.81 U$1.GPIO4 | v29.84,45.21 26.51,41.88 26.51,39.02 25.56,38.06 v25.56,29.49
  Bottom 0.152: v50.01,49.18 IC1.4 | v29.84,45.21 35.88,51.24 35.88,59.97 J12.10 | v25.56,29.49 25.08,29.02 25.08,26.63 U$2.19/A5
SDA  (via drill 0.33)
  Top 0.152: v45.72,52.83 38.58,59.97 J12.11 | U$2.18/A4 31.75,15.52 JP1.3 | U$1.GPIO5 15.24,33.46 20.16,28.54 v25.72,28.54
  Bottom 0.152: IC1.5 47.15,49.18 45.72,50.61 v45.72,52.83 | U$2.18/A4 v25.72,28.54 | U$1.GPIO5 15.24,56.16 11.91,59.5 11.91,60.45 13.18,61.72 35.88,61.72 37.46,60.13 38.42,60.13 J12.11
TX  (via drill 0.33)
  Top 0.152: RJ3.1 18.41,35.84 16.83,37.43 | v12.06,49.18 18.89,42.35 18.89,39.49 16.83,37.43 | 16.83,37.43 U$2.1
  Bottom 0.152: JP3.2 12.06,51.72 v12.06,49.18 | JP1.8 29.05,9.81 27.78,8.54 16.67,8.54 15.87,9.33 15.87,13.78 11.59,18.06 11.59,20.6 12.38,21.4 14.29,21.4 15.4,22.51 15.4,36.64 U$2.1
XPD
  Bottom 0.152: U$1.XPD 24.29,42.03 24.29,47.91 RJ1.2

### Text on the board
Top: @pastcompute
tNames: SCL | SDA | 1-W | GND | 3V3 | 5V | GND | TX | RX | 3v3 | 3v3 | PGM | RST | ADC | GND | TEENSY-LC | ESP-201 | RASPBERRY PI | GP4 | SCK | MOSI | MISO
Carambola: c2top.bmp | Scaled at 1mm == 79/1086px
Blocks: Shield spacing / 62.99 - 3.89 - 3.23 = 55.87